# EAGLE schematic OBI_SlaveBoard_rev1 (EAGLE 7.2.0)
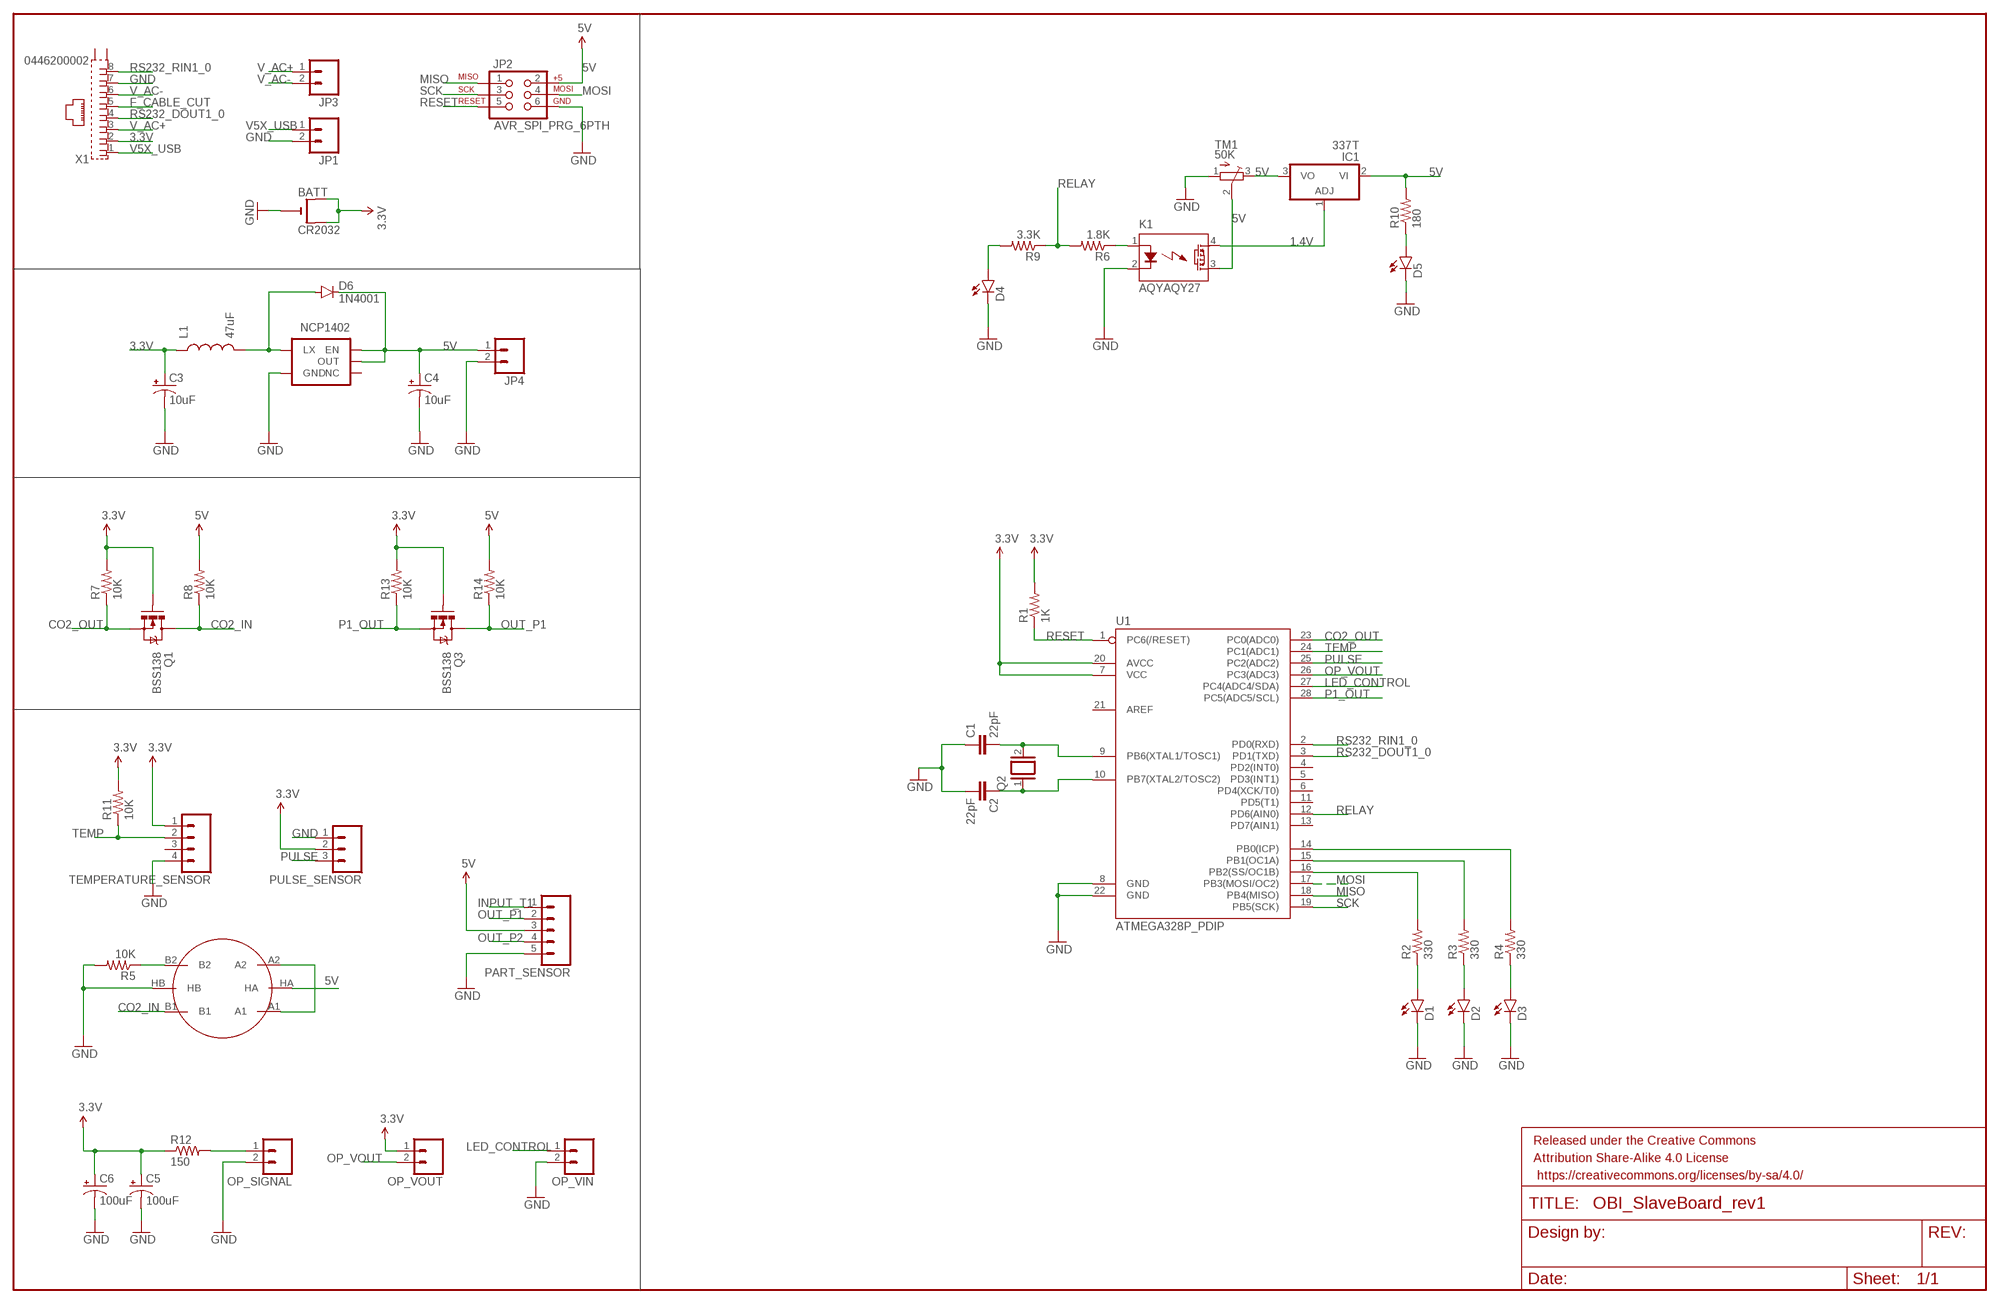
[diagram p0: schematic, sheet 1]

## Parts
BATT  CR2032  CR2032THM  [CR2032-THRU]
C1  22pF  CAPKIT  [CAP-PTH-SMALL-KIT]
C2  22pF  CAPKIT  [CAP-PTH-SMALL-KIT]
C3  10uF  CAP_POLPTH2  [CPOL-RADIAL-10UF-25V]
C4  10uF  CAP_POLPTH2  [CPOL-RADIAL-10UF-25V]
C5  100uF  CAP_POLPTH2  [CPOL-RADIAL-10UF-25V]
C6  100uF  CAP_POLPTH2  [CPOL-RADIAL-10UF-25V]
CO2_SENSOR  METHANE_SENSOR  [MQ-3]
D1  LED5MM  [LED5MM]
D2  LED5MM  [LED5MM]
D3  LED5MM  [LED5MM]
D4  LED5MM  [LED5MM]
D5  LED5MM  [LED5MM]
D6  1N4001  DIODEPTH  [DIODE-1N4001]
FRAME1  FRAME-LEDGER  [CREATIVE_COMMONS]
IC1  337T  [TO220H]
JP1  M023.5MM  [SCREWTERMINAL-3.5MM-2]
JP2  AVR_SPI_PRG_6PTH  [2X3]
JP3  M023.5MM  [SCREWTERMINAL-3.5MM-2]
JP4  M023.5MM  [SCREWTERMINAL-3.5MM-2]
K1  AQYAQY27  [AQY27]
L1  47uF  INDUCTORCR54  [CR54]
NCP1402  V_REG_NCP1400SOT23-5  [SOT23-5]
OP_SIGNAL  M023.5MM  [SCREWTERMINAL-3.5MM-2]
OP_VIN  M023.5MM  [SCREWTERMINAL-3.5MM-2]
OP_VOUT  M023.5MM  [SCREWTERMINAL-3.5MM-2]
PART_SENSOR  M05JST  [JST-5-PTH]
PULSE_SENSOR  M03-SCREW-5MM  [SCREWTERMINAL-5MM-3]
Q1  BSS138  MOSFET-NCHANNEL2N7000  [TO-92]
Q2  XTAL/S  [QS]
Q3  BSS138  MOSFET-NCHANNEL2N7000  [TO-92]
R1  1K  RESISTORPTH-1/4W  [AXIAL-0.4]
R2  330  RESISTORPTH-1/4W  [AXIAL-0.4]
R3  330  RESISTORPTH-1/4W  [AXIAL-0.4]
R4  330  RESISTORPTH-1/4W  [AXIAL-0.4]
R5  10K  RESISTORPTH-1/4W  [AXIAL-0.4]
R6  1.8K  RESISTORPTH-1/4W  [AXIAL-0.4]
R7  10K  RESISTORPTH-1/4W  [AXIAL-0.4]
R8  10K  RESISTORPTH-1/4W  [AXIAL-0.4]
R9  3.3K  RESISTORPTH-1/4W  [AXIAL-0.4]
R10  180  RESISTORPTH-1/4W  [AXIAL-0.4]
R11  10K  RESISTORPTH-1/4W  [AXIAL-0.4]
R12  150  RESISTORPTH-1/4W  [AXIAL-0.4]
R13  10K  RESISTORPTH-1/4W  [AXIAL-0.4]
R14  10K  RESISTORPTH-1/4W  [AXIAL-0.4]
TEMPERATURE_SENSOR  M04SCREW  [SCREWTERMINAL-3.5MM-4]
TM1  50K  TRIMPOTTC33X  [TC33X]
U1  ATMEGA328P_PDIP  [DIL28-3]
X1  0446200002  [0446200002]

## Nets
1.4V: IC1.1(ADJ) K1.4(DS1)
3.3V: BATT.+1(+) BATT.+2(+1) C3.1(+) C5.1(+) C6.1(+) L1.P$1 OP_VOUT.1 PULSE_SENSOR.2 Q1.2(G) Q3.2(G) R1.P$2 R7.P$2 R11.P$2 R12.P$1 R13.P$2 TEMPERATURE_SENSOR.1 U1.7(VCC) U1.20(AVCC) X1.2
5V: C4.1(+) CO2_SENSOR.HA D6.C IC1.2(VI) IC1.3(VO) JP2.2 JP4.1 K1.3(DS2) NCP1402.1(EN) NCP1402.2(OUT) PART_SENSOR.3 R8.P$2 R10.P$2 R14.P$2 TM1.2(S) TM1.3(E)
CO2_IN: CO2_SENSOR.B1 Q1.3(D) R8.P$1
CO2_OUT: Q1.1(S) R7.P$1 U1.23(PC0(ADC0))
F_CABLE_CUT: X1.5
GND: BATT.- C1.1 C2.2 C3.2(-) C4.2(-) C5.2(-) C6.2(-) CO2_SENSOR.HB D1.K(C) D2.K(C) D3.K(C) D4.K(C) D5.K(C) JP1.2 JP2.6 JP4.2 K1.2(K) NCP1402.4(GND) OP_SIGNAL.2 OP_VIN.2 PART_SENSOR.5 PULSE_SENSOR.1 R5.P$2 TEMPERATURE_SENSOR.4 TM1.1(A) U1.8(GND) U1.22(GND) X1.7
INPUT_T1: PART_SENSOR.1
LED_CONTROL: OP_VIN.1 U1.27(PC4(ADC4/SDA))
MISO: JP2.1 U1.18(PB4(MISO))
MOSI: JP2.4 U1.17(PB3(MOSI/OC2))
N$1: D5.A R10.P$1
N$2: K1.1(A) R6.P$1
N$3: C1.2 Q2.2 U1.9(PB6(XTAL1/TOSC1))
N$4: D6.A L1.P$2 NCP1402.5(LX)
N$8: R2.P$2 U1.16(PB2(SS/OC1B))
N$9: D1.A R2.P$1
N$10: R3.P$2 U1.15(PB1(OC1A))
N$11: D2.A R3.P$1
N$12: R4.P$2 U1.14(PB0(ICP))
N$13: D3.A R4.P$1
N$15: CO2_SENSOR.A1 CO2_SENSOR.A2
N$16: C2.1 Q2.1 U1.10(PB7(XTAL2/TOSC2))
N$17: CO2_SENSOR.B2 R5.P$1
N$19: D4.A R9.P$2
N$20: OP_SIGNAL.1 R12.P$2
OP_VOUT: OP_VOUT.2 U1.26(PC3(ADC3))
OUT_P1: PART_SENSOR.2 Q3.3(D) R14.P$1
OUT_P2: PART_SENSOR.4
P1_OUT: Q3.1(S) R13.P$1 U1.28(PC5(ADC5/SCL))
PULSE: PULSE_SENSOR.3 U1.25(PC2(ADC2))
RELAY: R6.P$2 R9.P$1 U1.12(PD6(AIN0))
RESET: JP2.5 R1.P$1 U1.1(PC6(/RESET))
RS232_DOUT1_0: U1.3(PD1(TXD)) X1.4
RS232_RIN1_0: U1.2(PD0(RXD)) X1.8
SCK: JP2.3 U1.19(PB5(SCK))
TEMP: R11.P$1 TEMPERATURE_SENSOR.2 U1.24(PC1(ADC1))
V5X_USB: JP1.1 X1.1
V_AC+: JP3.1 X1.3
V_AC-: JP3.2 X1.6
Unconnected: NCP1402.3(NC) TEMPERATURE_SENSOR.3 U1.4(PD2(INT0)) U1.5(PD3(INT1)) U1.6(PD4(XCK/T0)) U1.11(PD5(T1)) U1.13(PD7(AIN1)) U1.21(AREF) X1.S@1(S1) X1.S@2(S2)

## Library data of the parts
BATT = adafruit:CR2032
C1 C2 = SparkFun-Passives:CAP: Capacitor Standard 0603 ceramic capacitor, and 0.1" leaded capacitor.
C3-C6 = SparkFun-Capacitors:CAP_POL: Capacitor Polarized These are standard SMD and PTH capacitors. Normally 10uF, 47uF, and 100uF in electrolytic and tantalum varieties. Always verify the external diameter of the through hole cap, it varies with capacity, voltage, and manufacturer. The EIA devices should be standard.
CO2_SENSOR = SparkFun-Sensors:METHANE_SENSOR: MQ-4 Methane Gas Sensor SEN-09404
D1-D5 = SparkFun-LED:LED: LEDs Standard schematic elements and footprints for 5mm, 3mm, 1206, and 0603 sized LEDs. 5mm - Spark Fun Electronics SKU : COM-00529 (and others)
D6 = SparkFun-DiscreteSemi:DIODE: Diode These are standard reverse protection diodes and small signal diodes. SMA package can handle up to about 1A. SOD-323 can handle about 200mA. What the SOD-323 package when ordering, there are some mfgs out there that are 5-pin packages.
FRAME1 = SparkFun-Aesthetics:FRAME-LEDGER: Schematic Frame Standard 11x14 US Ledger frame
IC1 = linear:*337: Negative VOLTAGE REGULATOR
JP1 JP3 JP4 OP_SIGNAL OP_VIN OP_VOUT = SparkFun-Connectors:M02: Standard 2-pin 0.1" header. Use with - straight break away headers ( PRT-00116) - right angle break away headers (PRT-00553) - swiss pins (PRT-00743) - machine pins (PRT-00117) - female headers (PRT-00115) Molex polarized connector foot print use with: PRT-08233 with associated crimp pins and housings. 2.54_SCREWTERM for use with PRT-10571. 3.5mm Screw Terminal footprints for PRT-08084 5mm Screw Terminal footprints for use with PRT-08432; PROD_ID: CONN-08399
JP2 = SparkFun-Connectors:AVR_SPI_PRG_6: AVR ISP 6 Pin This is the reduced ISP connector for AVR programming. Common on Arduino. This footprint will take up less PCB space and can be used with a 10-pin to 6-pin adapter such as SKU: BOB-08508 **Special note about "TEST_POINT" package. The stop mask is on the top side, so if you want your programming test points to be on the bottom of your board, make sure to place this package on the bottom side of the board. This also ensure that the orientation to program from the bottom side will be correct.
K1 = relay:AQY*: PhotoMOS Relay NAiS Source: http://www.panasonic-electric-works.com/catalogues/downloads/photomos/ds_x615_en_aqz10_20.pdf; OC_FARNELL: unknown; OC_NEWARK: unknown
L1 = SparkFun-Passives:INDUCTOR: Inductors Basic Inductor/Choke - 0603 and 1206. Footprints are not proven and vary greatly between part numbers. SRN6045- 33uH, 20% 1.4A SDR0403-560KL - 56uH, 10%, 500mA RMS/740mA peak
NCP1402 = SparkFun-PowerIC:V_REG_NCP1400: Switching step-up voltage regulator NCP1400 switiching regulator takes single cell AA and outputs 100mA at 3.3V or 5V with minimal number of external components.
PART_SENSOR = SparkFun-Connectors:M05: Header 5 Standard 5-pin 0.1" header. Use with straight break away headers (SKU : PRT-00116), right angle break away headers (PRT-00553), swiss pins (PRT-00743), machine pins (PRT-00117), and female headers (PRT-00115). Molex polarized connector foot print use with SKU : PRT-08230 with associated crimp pins and housings.
PULSE_SENSOR = SparkFun-Connectors:M03: Header 3 Standard 3-pin 0.1" header. Use with straight break away headers (SKU : PRT-00116), right angle break away headers (PRT-00553), swiss pins (PRT-00743), machine pins (PRT-00117), and female headers (PRT-00115). Molex polarized connector foot print use with SKU : PRT-08232 with associated crimp pins and housings.; STOREFRONT_ID: PRT-08433
Q1 Q3 = SparkFun-DiscreteSemi:MOSFET-NCHANNEL: Common NMOSFET Parts MFG P/N Store ID Prod ID FDD8780 TRANS-09984 SI7820DN TRANS-11055 FDS6630A IC-08089 2N7002PW TRANS-11151 FQP30N06L COM-10213 TRANS-10060 BSS123LT1G TRANS-08345 BSS138 TRANS-00830 BS170 2N7000
Q2 = special:XTAL/S: CRYSTAL
R1 R5-R9 R13 R14 = SparkFun-Passives:RESISTOR: Resistor Basic schematic elements and footprints for 0603, 1206, and PTH resistors.
R2-R4 R10-R12 = SparkFun-Resistors:RESISTOR: Resistor Basic schematic elements and footprints for 0603, 1206, and PTH resistors.
TEMPERATURE_SENSOR = SparkFun-Connectors:M04: Header 4 Standard 4-pin 0.1" header. Use with straight break away headers (SKU : PRT-00116), right angle break away headers (PRT-00553), swiss pins (PRT-00743), machine pins (PRT-00117), and female headers (PRT-00115). Molex polarized connector foot print use with SKU : PRT-08231 with associated crimp pins and housings. 1MM SMD Version SKU: PRT-10208
TM1 = adafruit:TRIMPOT: SMT trimmer potentiometer part number TC33X http://www.ladyada.net/library/eagle
U1 = SparkFun-DigitalIC:ATMEGA328P_PDIP: uC used in the Arduino 32kb flash, 1k EEPROM, 2k SRAM This is the through-hole version of this chip.
X1 = con-molex:0446200002: RJ-45 INVERTED MODULAR JACK ASSEMBLY WITH RJ-11 KEEPOUT FEATURE Source: Data sheet <http://www.farnell.com/datasheets/73207.pdf> MOLEX 0446200002 BUCHSE, RJ45, GESCHIRMT Source: Farnell <http://de.farnell.com/molex/0446200002/buchse-rj45-geschirmt/dp/9251910?ost=9251910>; MF: MOLEX; MPN: 0446200002; OC_FARNELL: 9251910